# Altium schematic sheet VoltageDivider_REF.SchDoc
size A
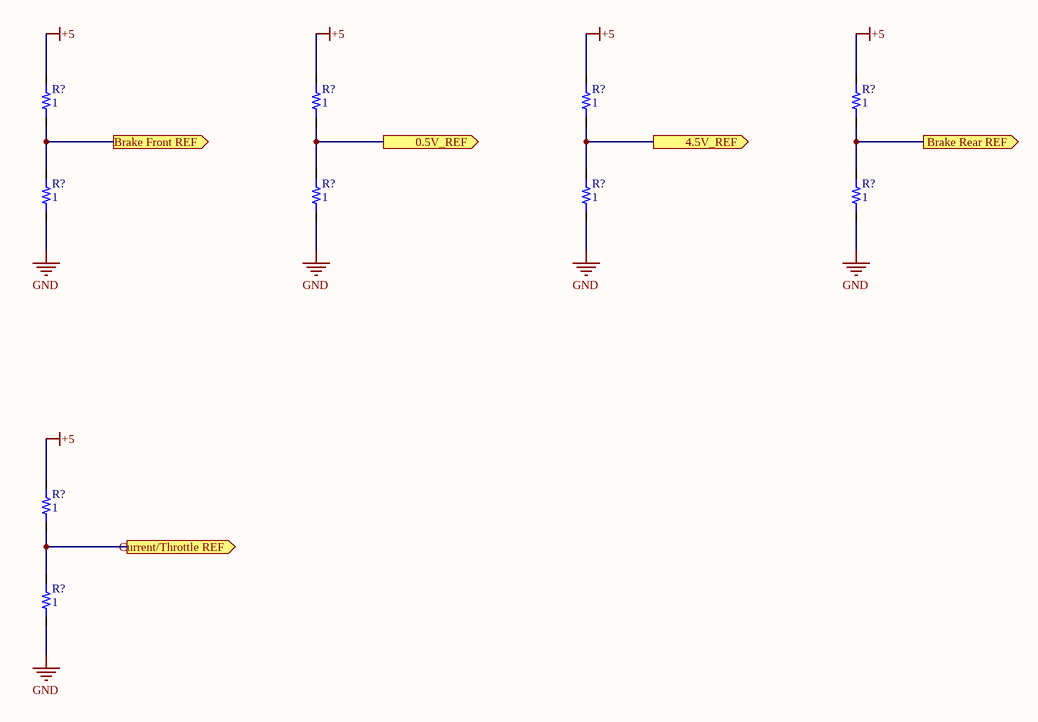
[diagram p0: VoltageDivider_REF.SchDoc]

## Parts
(Parts that share a designator on the sheet are numbered #1, #2 ... from top to bottom, then left to right.)
R?#1  resistance: 1  [0603]  (hidden comment: resistor)
R?#2  resistance: 1  [0603]  (hidden comment: resistor)
R?#3  resistance: 1  [0603]  (hidden comment: resistor)
R?#4  resistance: 1  [0603]  (hidden comment: resistor)
R?#5  resistance: 1  [0603]  (hidden comment: resistor)
R?#6  resistance: 1  [0603]  (hidden comment: resistor)
R?#7  resistance: 1  [0603]  (hidden comment: resistor)
R?#8  resistance: 1  [0603]  (hidden comment: resistor)
R?#9  resistance: 1  [0603]  (hidden comment: resistor)
R?#10  resistance: 1  [0603]  (hidden comment: resistor)

## Ports
0.5V_REF (out), 4.5V_REF (out), Brake Front REF (out), Brake Rear REF (out), Current/Throttle REF (out)

## Nets
+5: R?#1.1 R?#2.1 R?#3.1 R?#4.1 R?#9.1
GND: R?#5.2 R?#6.2 R?#7.2 R?#8.2 R?#10.2
0.5V_REF: R?#2.2 R?#6.1 ; port 0.5V_REF
4.5V_REF: R?#3.2 R?#7.1 ; port 4.5V_REF
Brake Front REF: R?#1.2 R?#5.1 ; port Brake Front REF
Brake Rear REF: R?#4.2 R?#8.1 ; port Brake Rear REF
Current/Throttle REF: R?#9.2 R?#10.1 ; port Current/Throttle REF

## Library data of the parts
R?#1-R?#10 = 1: name: 0603 Resistor; percent tolerance: 5; id: 1; package: 0603; quantity: 0